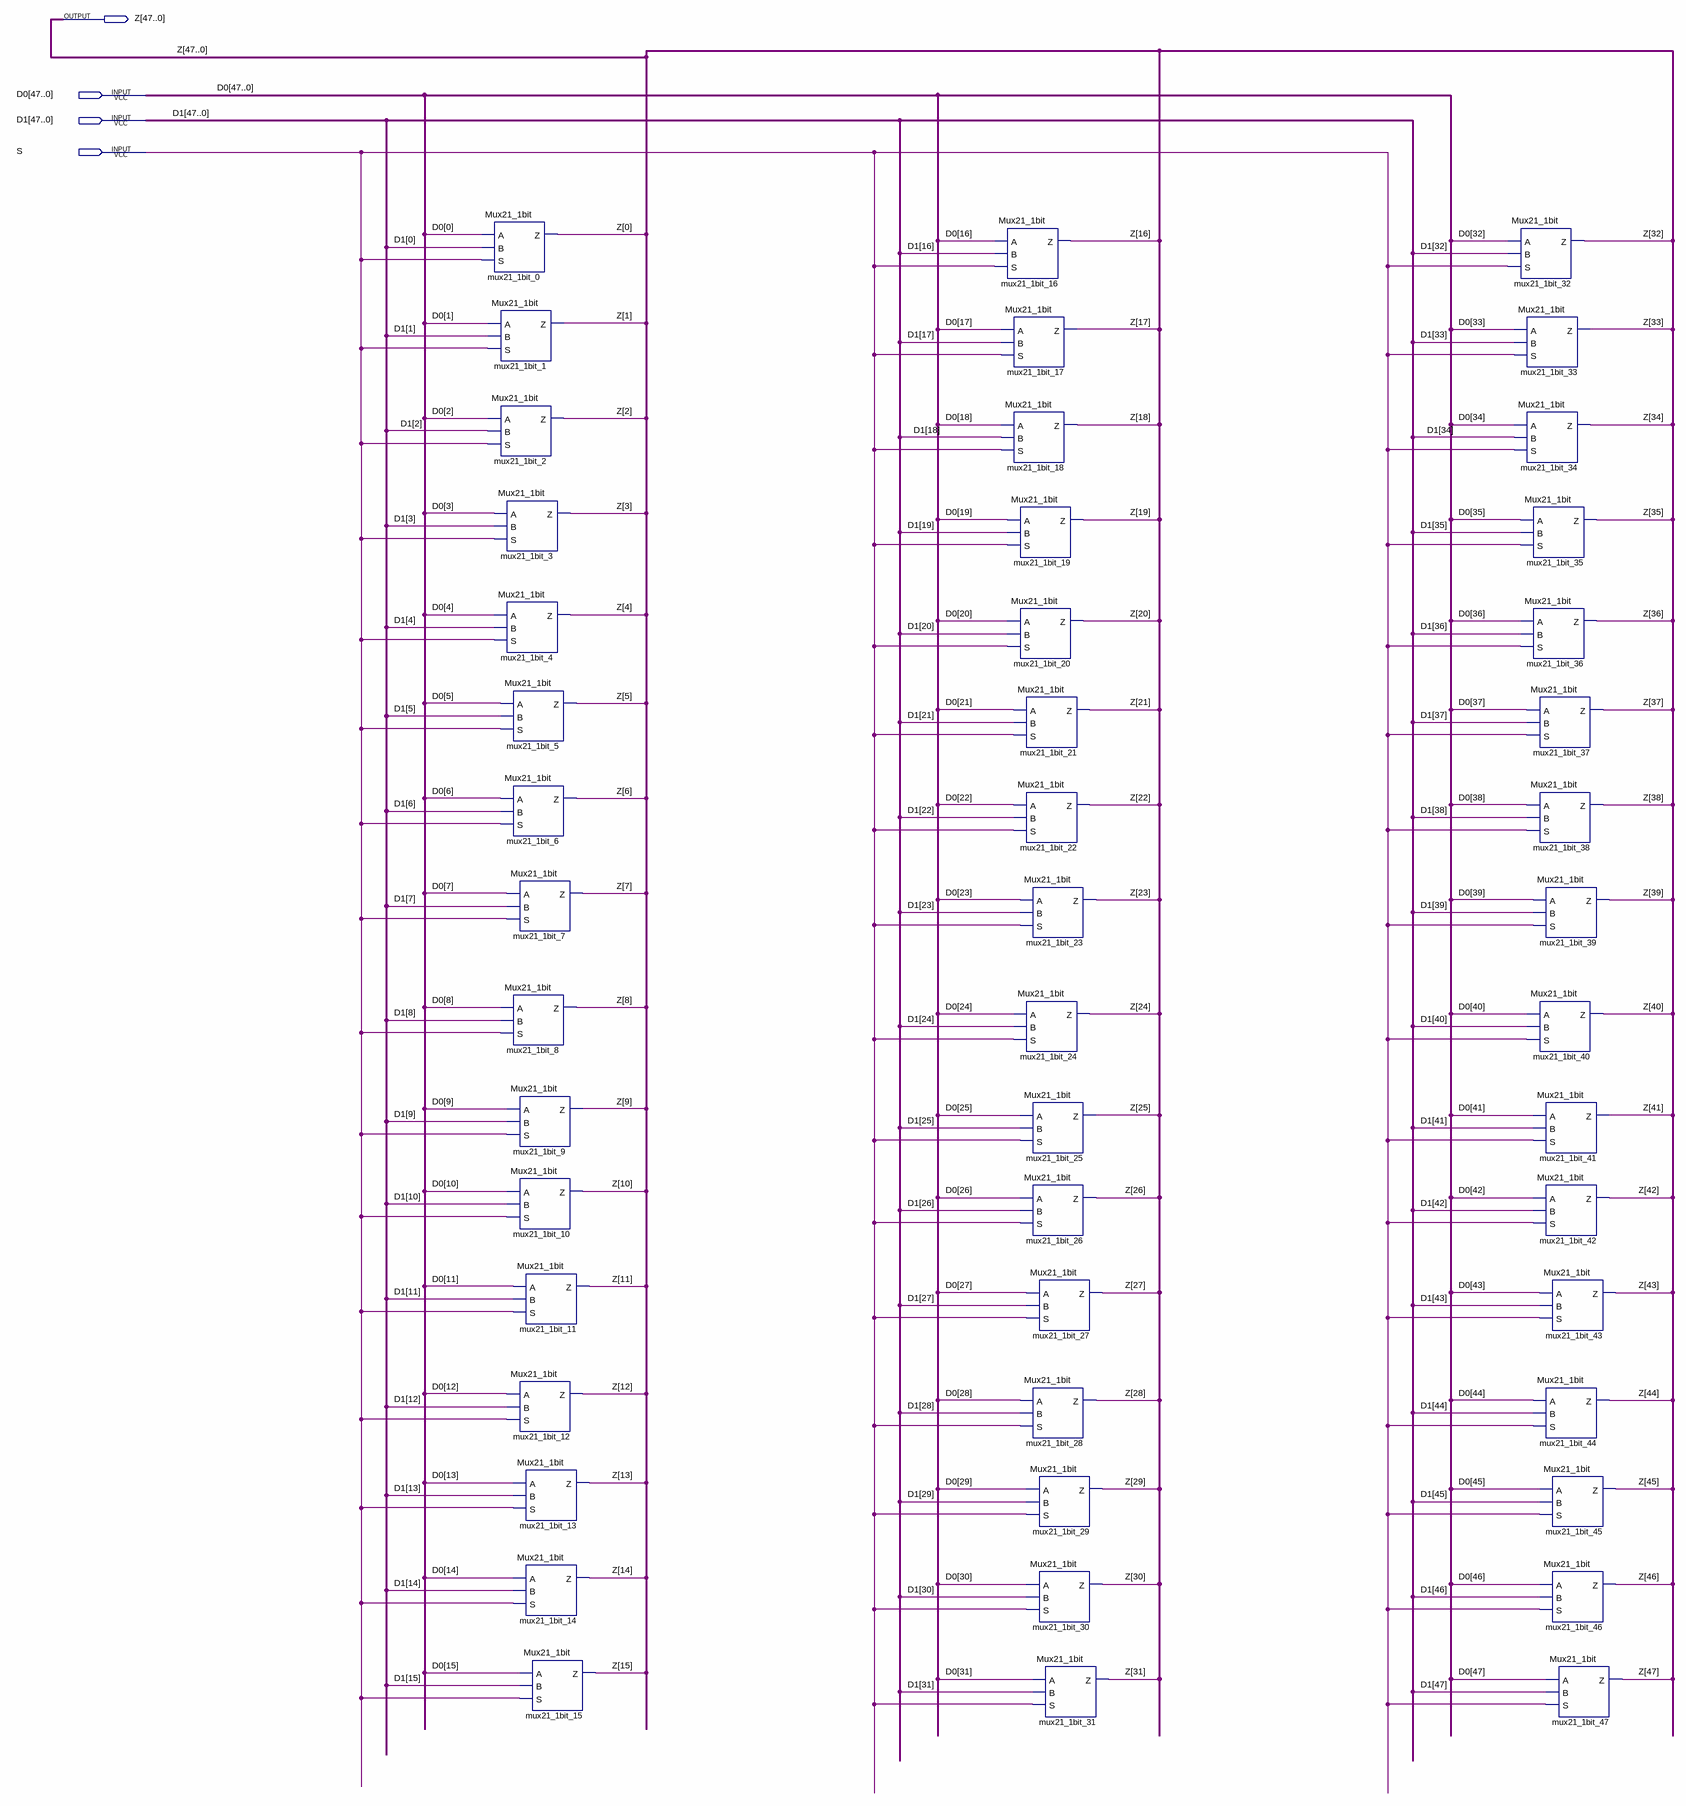
[diagram p0: schematic sheet]
// Quartus schematic Mux21_48bit.bdf as structural Verilog: 48 symbols, 4 pins
module Mux21_48bit (
  input  [47:0] D0,
  input  [47:0] D1,
  input  S,
  output [47:0] Z
);

  Mux21_1bit mux21_1bit_0 (.A(D0[0]), .B(D1[0]), .S(S), .Z(Z[0]));
  Mux21_1bit mux21_1bit_1 (.A(D0[1]), .B(D1[1]), .S(S), .Z(Z[1]));
  Mux21_1bit mux21_1bit_2 (.A(D0[2]), .B(D1[2]), .S(S), .Z(Z[2]));
  Mux21_1bit mux21_1bit_3 (.A(D0[3]), .B(D1[3]), .S(S), .Z(Z[3]));
  Mux21_1bit mux21_1bit_4 (.A(D0[4]), .B(D1[4]), .S(S), .Z(Z[4]));
  Mux21_1bit mux21_1bit_5 (.A(D0[5]), .B(D1[5]), .S(S), .Z(Z[5]));
  Mux21_1bit mux21_1bit_6 (.A(D0[6]), .B(D1[6]), .S(S), .Z(Z[6]));
  Mux21_1bit mux21_1bit_7 (.A(D0[7]), .B(D1[7]), .S(S), .Z(Z[7]));
  Mux21_1bit mux21_1bit_8 (.A(D0[8]), .B(D1[8]), .S(S), .Z(Z[8]));
  Mux21_1bit mux21_1bit_9 (.A(D0[9]), .B(D1[9]), .S(S), .Z(Z[9]));
  Mux21_1bit mux21_1bit_10 (.A(D0[10]), .B(D1[10]), .S(S), .Z(Z[10]));
  Mux21_1bit mux21_1bit_11 (.A(D0[11]), .B(D1[11]), .S(S), .Z(Z[11]));
  Mux21_1bit mux21_1bit_12 (.A(D0[12]), .B(D1[12]), .S(S), .Z(Z[12]));
  Mux21_1bit mux21_1bit_13 (.A(D0[13]), .B(D1[13]), .S(S), .Z(Z[13]));
  Mux21_1bit mux21_1bit_14 (.A(D0[14]), .B(D1[14]), .S(S), .Z(Z[14]));
  Mux21_1bit mux21_1bit_15 (.A(D0[15]), .B(D1[15]), .S(S), .Z(Z[15]));
  Mux21_1bit mux21_1bit_16 (.A(D0[16]), .B(D1[16]), .S(S), .Z(Z[16]));
  Mux21_1bit mux21_1bit_17 (.A(D0[17]), .B(D1[17]), .S(S), .Z(Z[17]));
  Mux21_1bit mux21_1bit_18 (.A(D0[18]), .B(D1[18]), .S(S), .Z(Z[18]));
  Mux21_1bit mux21_1bit_19 (.A(D0[19]), .B(D1[19]), .S(S), .Z(Z[19]));
  Mux21_1bit mux21_1bit_20 (.A(D0[20]), .B(D1[20]), .S(S), .Z(Z[20]));
  Mux21_1bit mux21_1bit_21 (.A(D0[21]), .B(D1[21]), .S(S), .Z(Z[21]));
  Mux21_1bit mux21_1bit_22 (.A(D0[22]), .B(D1[22]), .S(S), .Z(Z[22]));
  Mux21_1bit mux21_1bit_23 (.A(D0[23]), .B(D1[23]), .S(S), .Z(Z[23]));
  Mux21_1bit mux21_1bit_24 (.A(D0[24]), .B(D1[24]), .S(S), .Z(Z[24]));
  Mux21_1bit mux21_1bit_25 (.A(D0[25]), .B(D1[25]), .S(S), .Z(Z[25]));
  Mux21_1bit mux21_1bit_26 (.A(D0[26]), .B(D1[26]), .S(S), .Z(Z[26]));
  Mux21_1bit mux21_1bit_28 (.A(D0[28]), .B(D1[28]), .S(S), .Z(Z[28]));
  Mux21_1bit mux21_1bit_27 (.A(D0[27]), .B(D1[27]), .S(S), .Z(Z[27]));
  Mux21_1bit mux21_1bit_29 (.A(D0[29]), .B(D1[29]), .S(S), .Z(Z[29]));
  Mux21_1bit mux21_1bit_30 (.A(D0[30]), .B(D1[30]), .S(S), .Z(Z[30]));
  Mux21_1bit mux21_1bit_31 (.A(D0[31]), .B(D1[31]), .S(S), .Z(Z[31]));
  Mux21_1bit mux21_1bit_32 (.A(D0[32]), .B(D1[32]), .S(S), .Z(Z[32]));
  Mux21_1bit mux21_1bit_33 (.A(D0[33]), .B(D1[33]), .S(S), .Z(Z[33]));
  Mux21_1bit mux21_1bit_34 (.A(D0[34]), .B(D1[34]), .S(S), .Z(Z[34]));
  Mux21_1bit mux21_1bit_35 (.A(D0[35]), .B(D1[35]), .S(S), .Z(Z[35]));
  Mux21_1bit mux21_1bit_36 (.A(D0[36]), .B(D1[36]), .S(S), .Z(Z[36]));
  Mux21_1bit mux21_1bit_37 (.A(D0[37]), .B(D1[37]), .S(S), .Z(Z[37]));
  Mux21_1bit mux21_1bit_38 (.A(D0[38]), .B(D1[38]), .S(S), .Z(Z[38]));
  Mux21_1bit mux21_1bit_40 (.A(D0[40]), .B(D1[40]), .S(S), .Z(Z[40]));
  Mux21_1bit mux21_1bit_39 (.A(D0[39]), .B(D1[39]), .S(S), .Z(Z[39]));
  Mux21_1bit mux21_1bit_41 (.A(D0[41]), .B(D1[41]), .S(S), .Z(Z[41]));
  Mux21_1bit mux21_1bit_42 (.A(D0[42]), .B(D1[42]), .S(S), .Z(Z[42]));
  Mux21_1bit mux21_1bit_43 (.A(D0[43]), .B(D1[43]), .S(S), .Z(Z[43]));
  Mux21_1bit mux21_1bit_44 (.A(D0[44]), .B(D1[44]), .S(S), .Z(Z[44]));
  Mux21_1bit mux21_1bit_45 (.A(D0[45]), .B(D1[45]), .S(S), .Z(Z[45]));
  Mux21_1bit mux21_1bit_46 (.A(D0[46]), .B(D1[46]), .S(S), .Z(Z[46]));
  Mux21_1bit mux21_1bit_47 (.A(D0[47]), .B(D1[47]), .S(S), .Z(Z[47]));
endmodule
